# Altium schematic sheet 2_Input Signal Conditioner.SchDoc
size A4; SheetNumber: 2; SheetTotal: 5
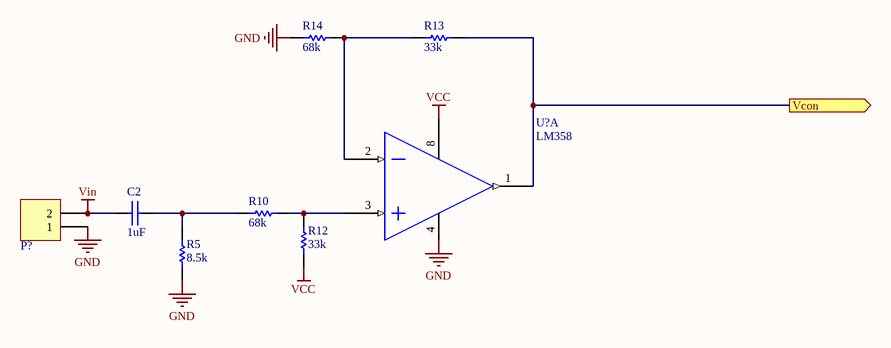
[diagram p0: 2_Input Signal Conditioner.SchDoc]

## Parts
C2  1uF  [ece-RAD0.2]
P?  Header 2  [ece-TER2-10MM]  (value not drawn)
R5  8.5k  [ece-AXIAL0.4]
R10  68k  [ece-AXIAL0.4]
R12  33k  [ece-AXIAL0.4]
R13  33k  [ece-AXIAL0.4]
R14  68k  [ece-AXIAL0.4]
U?  LM358  [ECE-DIP8]  (part A of 2)

## Ports
Vcon (out)

## Nets
GND: P?.1 R5.1 R14.1
VCC: R12.1 U?.8(V(+))
Vin: C2.1 P?.2
Vcon: R13.2 U?.1(OUT1) ; port Vcon
NetC2_2: C2.2 R5.2 R10.1
NetR10_2: R10.2 R12.2 U?.3(IN1(+))
NetR13_1: R13.1 R14.2 U?.2(IN1(-))

Not connected (* = marked no-connect by the designer): U? 4(GND)

## Notes on the sheet
- Labels drawn without touching a wire or pin: GND

## Library data of the parts
C2 = CAP: Capacitor Non Polarised Through Hole; Value: *
P? = TERMINAL 2: Large 2 way screw connector
R5 R10 R12-R14 = Res1: Resistor; Published: 8-Jun-2000; LatestRevisionDate: 17-Jul-2002; LatestRevisionNote: Re-released for DXP Platform.; PackageReference: AXIAL-0.3; Publisher: Altium Limited; Value: *
U? = TLC082: Value: TLC082